# Altium schematic sheet 04_SIM.SchDoc
size A4
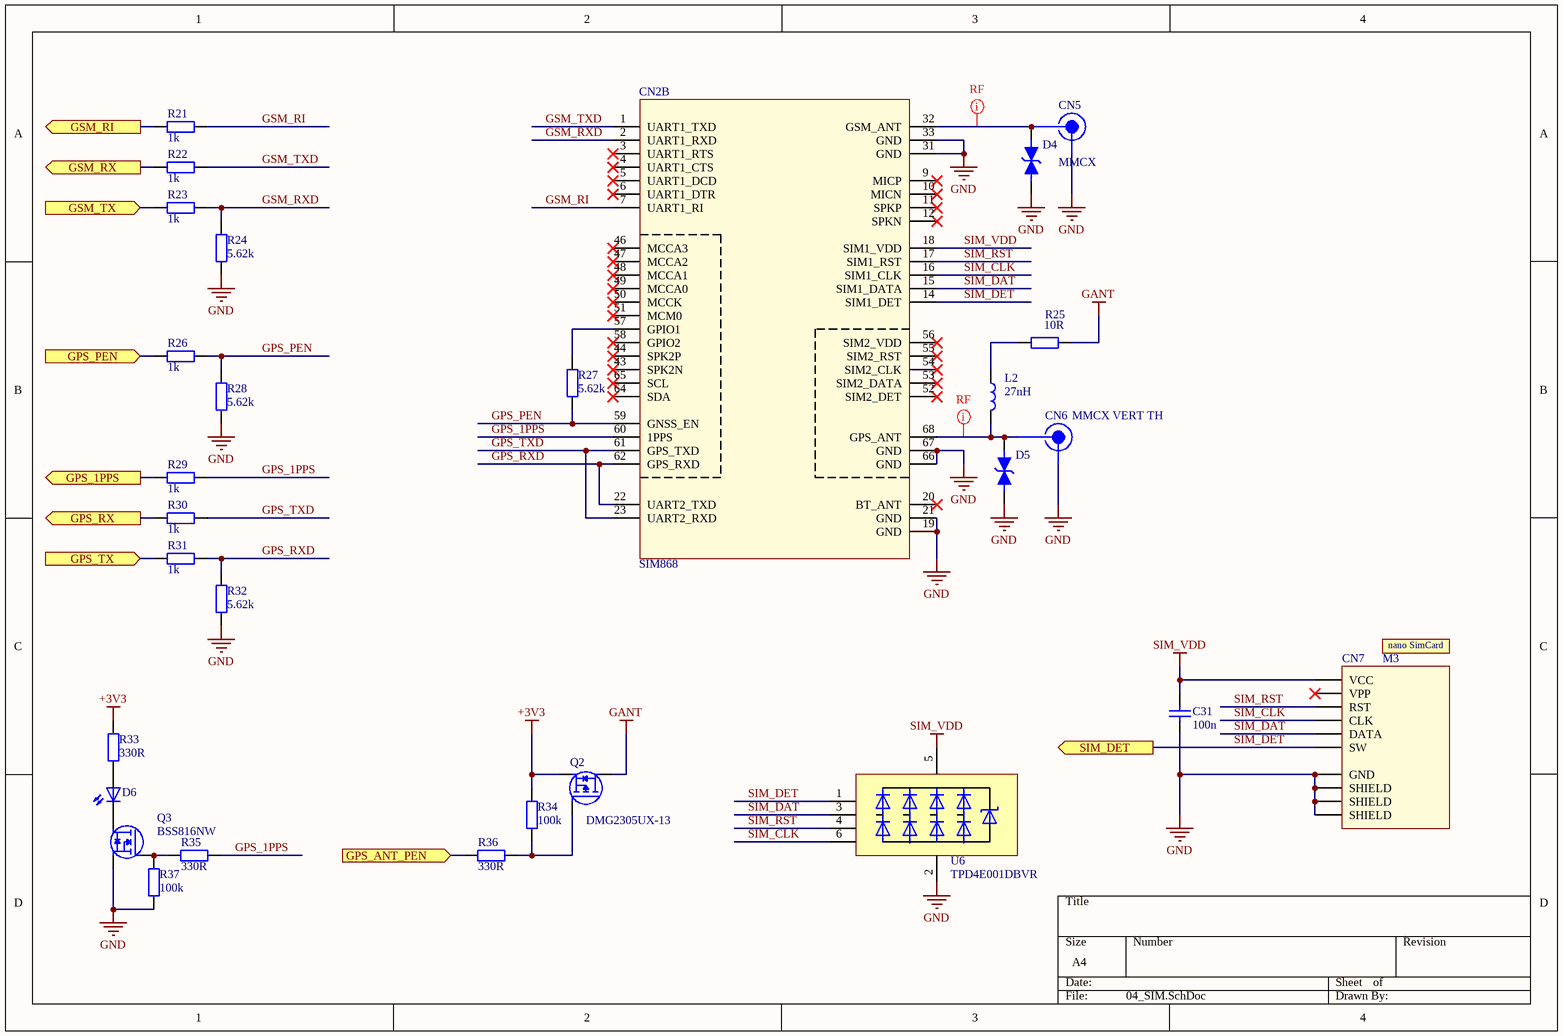
[diagram p0: 04_SIM.SchDoc]

## Parts
C31  100n  [C0603_IPC_MD]
CN2  SIM868  [SIM868]  (part B of 2)
CN5  MMCX  [MMCX_EDGE]
CN6  MMCX VERT TH  [MMCX_VERT_TH]
CN7  SNO-1305-B  [SNO-1305-B]  (value not drawn)
D4  LXES15AAA1-153  [C0402_IPC_MD]  (value not drawn)
D5  LXES15AAA1-153  [C0402_IPC_MD]  (value not drawn)  (no BOM)
D6  LTST-C190GKT  [LED_0603]  (value not drawn)
L2  27nH  [L0603_IPC_MD]
M3  SIMCARD-NANO  (value not drawn)  (mechanical)
Q2  DMG2305UX-13  [SOT23]
Q3  BSS816NW  [SOT323]
R21  1k  [R0603_IPC_MD]
R22  1k  [R0603_IPC_MD]
R23  1k  [R0603_IPC_MD]
R24  5.62k  [R0603_IPC_MD]
R25  10R  [R0603_IPC_MD]
R26  1k  [R0603_IPC_MD]  (no BOM)
R27  5.62k  [R0603_IPC_MD]
R28  5.62k  [R0603_IPC_MD]  (no BOM)
R29  1k  [R0603_IPC_MD]
R30  1k  [R0603_IPC_MD]  (no BOM)
R31  1k  [R0603_IPC_MD]  (no BOM)
R32  5.62k  [R0603_IPC_MD]
R33  330R  [R0603_IPC_MD]
R34  100k  [R0603_IPC_MD]
R35  330R  [R0603_IPC_MD]
R36  330R  [R0603_IPC_MD]
R37  100k  [R0603_IPC_MD]
U6  TPD4E001DBVR  [SOT23-6]

## Ports
GPS_1PPS (out), GPS_ANT_PEN (in), GPS_PEN (in), GPS_RX (out), GPS_TX (in), GSM_RI (out), GSM_RX (out), GSM_TX (in), SIM_DET (out)

## Nets
+3V3: Q2.2(S) R33.2 R34.2
GANT: Q2.3(D) R25.2
GND: C31.1 CN2.19(GND) CN2.21(GND) CN2.31(GND) CN2.33(GND) CN2.66(GND) CN2.67(GND) CN5.1 CN6.1 CN7.C5(GND) CN7.S1(SHIELD) CN7.S2(SHIELD) CN7.S3(SHIELD) D4.1 D5.1 Q3.2(S) R24.1 R28.1 R32.1 R37.1 U6.2(GND)
SIM_VDD: C31.2 CN2.18(SIM1_VDD) CN7.C1(VCC) U6.5(VCC)
GPS_1PPS: CN2.60(1PPS) R29.2 R35.2
GPS_1PPS: R29.1 ; port GPS_1PPS  [a separate net that carries the same name]
GPS_ANT_PEN: R36.1 ; port GPS_ANT_PEN
GPS_PEN: CN2.59(GNSS_EN) R26.2 R27.1 R28.2
GPS_PEN: R26.1 ; port GPS_PEN  [a separate net that carries the same name]
GPS_RX: R30.1 ; port GPS_RX
GPS_RXD: CN2.22(UART2_TXD) CN2.62(GPS_RXD) R31.2 R32.2
GPS_TX: R31.1 ; port GPS_TX
GPS_TXD: CN2.23(UART2_RXD) CN2.61(GPS_TXD) R30.2
GSM_RI: CN2.7(UART1_RI) R21.2
GSM_RI: R21.1 ; port GSM_RI  [a separate net that carries the same name]
GSM_RX: R22.1 ; port GSM_RX
GSM_RXD: CN2.2(UART1_RXD) R23.2 R24.2
GSM_TX: R23.1 ; port GSM_TX
GSM_TXD: CN2.1(UART1_TXD) R22.2
SIM_CLK: CN2.16(SIM1_CLK) CN7.C3(CLK) U6.6(IO4)
SIM_DAT: CN2.15(SIM1_DATA) CN7.C7(DATA) U6.3(IO2)
SIM_DET: CN2.14(SIM1_DET) CN7.SW U6.1(IO1) ; port SIM_DET
SIM_RST: CN2.17(SIM1_RST) CN7.C2(RST) U6.4(IO3)
NetCN2_32: CN2.32(GSM_ANT) CN5.2 D4.2
NetCN2_57: CN2.57(GPIO1) R27.2
NetCN2_68: CN2.68(GPS_ANT) CN6.2 D5.2 L2.2
NetD6_1: D6.1(C) Q3.3(D)
NetD6_2: D6.2(A) R33.1
NetL2_1: L2.1 R25.1
NetQ2_1: Q2.1(G) R34.1 R36.2
NetQ3_1: Q3.1(G) R35.1 R37.2

Not connected (* = marked no-connect by the designer): CN2 3(UART1_RTS)* 4(UART1_CTS)* 5(UART1_DCD)* 6(UART1_DTR)* 9(MICP)* 10(MICN)* 11(SPKP)* 12(SPKN)* 20(BT_ANT)* 43(SPK2N)* 44(SPK2P)* 46(MCCA3)* 47(MCCA2)* 48(MCCA1)* 49(MCCA0)* 50(MCCK)* 51(MCM0)* 52(SIM2_DET)* 53(SIM2_DATA)* 54(SIM2_CLK)* 55(SIM2_RST)* 56(SIM2_VDD)* 58(GPIO2)* 64(SDA)* 65(SCL)*; CN7 C6(VPP)*

## Layout directives
net class RF50: NetCN2_32, NetCN2_68

## Notes on the sheet
- (in symbol SIMCARD-NANO) nano SimCard

## Library data of the parts
C31 = CL10B104KO8WPNC: CAP CER 0.1UF 16V X7R 0603; Manufacturer: Samsung Electro-Mechanics; Manufacturer Part Number: CL10B104KO8WPNC; Voltage: 16V; Value: 100n; Dielectric: X7R; Supplier 1: Digi-Key; Supplier Part Number 1: 1276-6582-1-ND
CN2 = SIM868: GSM & GPRS & GPS Modules PCBModule RoHS; Manufacturer: SIMCom Wireless Solutions; Manufacturer Part Number: SIM868; Supplier 1: LCSC; Supplier Part Number 1: C89549
CN5 = MMCX: MMCX PCB EDGE CONN; Manufacturer: China; Manufacturer Part Number: MMCX; Supplier 1: Aliexpress; Supplier Part Number 1: MMCX
CN6 = MMCX_VERT: MMCX PCB TH VERT CONN; Manufacturer: China; Manufacturer Part Number: MMCX VERT TH; Supplier 1: Aliexpress; Supplier Part Number 1: MMCX VERT TH
CN7 = SNO-1305-B: Hinged Sim Card Connector. With 6 contacts, with switch for card detection. Profile above PCB is 1.43mm.; Manufacturer: SOFNG; Manufacturer Part Number: SNO-1305-B; Supplier 1: LCSC; Supplier Part Number 1: C111371
D4 D5 = LXES15AAA1-153: TVS DIODE 4V 0402; Manufacturer: Murata Electronics North America; Manufacturer Part Number: LXES15AAA1-153; Voltage - Reverse Standoff (Typ): 4V; Supplier 1: Digi-Key; Supplier Part Number 1: 490-13210-1-ND
D6 = LTST-C190GKT: LED GREEN CLEAR CHIP SMD 0603; Manufacturer: Lite-On Inc.; Manufacturer Part Number: LTST-C190GKT; Color: Green; Supplier 1: Digi-Key; Supplier Part Number 1: 160-1183-1-ND
L2 = LQW18AN27NJ00D: 27nH Unshielded Wirewound Inductor 440mA 210mOhm Max 0603 (1608 Metric); Manufacturer: Murata Electronics; Manufacturer Part Number: LQW18AN27NJ00D; Supplier 1: Digi-Key; Supplier Part Number 1: 490-1174-1-ND; Value: 27nH
M3 = SIMCARD-NANO: Nano SimCard; Manufacturer: Beeline; Manufacturer Part Number: SIMCARD-NANO; Supplier 1: Beeline; Supplier Part Number 1: SIMCARD-NANO
Q2 = DMG2305: MOSFET P-CH 20V 4.2A SOT23; Manufacturer: Diodes Inc.; Manufacturer Part Number: DMG2305UX-13; Supplier 1: Digi-Key; Supplier Part Number 1: DMG2305UX-13DICT-ND
Q3 = BSS816: N-Channel Logic Level Enhancement Mode Field Effect Transistor; Manufacturer: Infineon Technologies; Manufacturer Part Number: BSS816NW; Supplier 1: Digi-Key; Supplier Part Number 1: BSS816NWH6327XTSA1CT-ND
R21-R23 R26 R29-R31 = CR0603-JW-102ELF: RES SMD 1K OHM 5% 1/10W 0603; Manufacturer: Bourns Inc.; Value: 1k; Tolarance: 5%; Manufacturer Part Number: CR0603-JW-102ELF; Supplier 1: Digi-Key; Supplier Part Number 1: CR0603-JW-102ELFCT-ND
R24 R27 R28 R32 = CR0603-JW-5.62kR: RES 5.62K OHM 1% 1/10W 0603; Manufacturer: Stackpole Electronics Inc; Manufacturer Part Number: RMCF0603FT5K62; Value: 5.62k; Tolarance: ±1%; Supplier 1: Digi-Key; Supplier Part Number 1: RMCF0603FT5K62CT-ND
R25 = CR0603-FX-10R0ELF: RES SMD 10 OHM 1% 1/10W 0603; Manufacturer: Bourns Inc.; Value: 10R; Tolarance: 1%; Manufacturer Part Number: CR0603-FX-10R0ELF; Supplier 1: Digi-Key; Supplier Part Number 1: CR0603-FX-10R0ELFCT-ND
R33 R35 R36 = CR0603-JW-331ELF: RES SMD 330 OHM 5% 1/10W 0603; Manufacturer: Bourns Inc.; Value: 330R; Tolarance: 5%; Manufacturer Part Number: CR0603-JW-331ELF; Supplier 1: Digi-Key; Supplier Part Number 1: CR0603-JW-331ELFCT-ND
R34 R37 = RMCF0603FT100K: RES 100K OHM 1% 1/10W 0603; Manufacturer: Bourns Inc.; Value: 100k; Tolarance: 1%; Manufacturer Part Number: RMCF0603FT100K; Supplier 1: Digi-Key; Supplier Part Number 1: RMCF0603FT100KCT-ND
U6 = TPD4E001DBVR: 4x TVS DIODE 5.5V SOT23-6; Manufacturer: TI; Manufacturer Part Number: TPD4E001DBVR; Supplier 1: Digi-Key; Supplier Part Number 1: 296-28203-1-ND